# Altium schematic sheet Sheet1.SchDoc
size A4
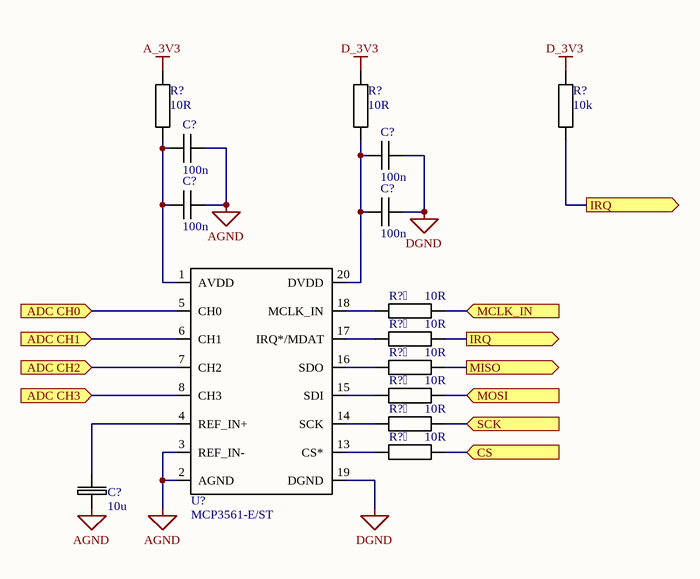
[diagram p0: Sheet1.SchDoc]

## Parts
(Parts that share a designator on the sheet are numbered #1, #2 ... from top to bottom, then left to right.)
C?#1  Capacitance: 100n  [1206 package]  (hidden comment: Ceramic Capacitor)
C?#2  Capacitance: 100n  [1206 package]  (hidden comment: Ceramic Capacitor)
C?#3  Capacitance: 100n  [1206 package]  (hidden comment: Ceramic Capacitor)
C?#4  Capacitance: 100n  [1206 package]  (hidden comment: Ceramic Capacitor)
C?#5  Capacitance: 10u  [B package]  (hidden comment: Electrolitic Capacitor)
R?#1  Resistance: 10R  [1206 package]  (hidden comment: SMD Resistor)
R?#2  Resistance: 10R  [1206 package]  (hidden comment: SMD Resistor)
R?#3  Resistance: 10R  [1206 package]  (hidden comment: SMD Resistor)
R?#4  Resistance: 10R  [1206 package]  (hidden comment: SMD Resistor)
R?#5  Resistance: 10R  [1206 package]  (hidden comment: SMD Resistor)
R?#6  Resistance: 10R  [1206 package]  (hidden comment: SMD Resistor)
R?#1  Resistance: 10R  [1206 package]  (hidden comment: SMD Resistor)
R?#2  Resistance: 10R  [1206 package]  (hidden comment: SMD Resistor)
R?#3  Resistance: 10k  [1206 package]  (hidden comment: SMD Resistor)
U?  MCP3561-E/ST

## Ports
ADC CH0 (in), ADC CH1 (in), ADC CH2 (in), ADC CH3 (in), CS (in), IRQ (out), MCLK_IN (in), MISO (out), MOSI (in), SCK (in)

## Nets
A_3V3: R?#1.2
AGND: C?#1.1 C?#3.1 C?#5.2 U?.2(AGND) U?.3(REF_IN-)
D_3V3: R?#2.2 R?#3.2
DGND: C?#2.1 C?#4.1 U?.19(DGND)
ADC CH0: U?.5(CH0) ; port ADC CH0
ADC CH1: U?.6(CH1) ; port ADC CH1
ADC CH2: U?.7(CH2) ; port ADC CH2
ADC CH3: U?.8(CH3) ; port ADC CH3
CS: R?#6.2 ; port CS
IRQ: R?#2.2 R?#3.1 ; port IRQ
MCLK_IN: R?#1.2 ; port MCLK_IN
MISO: R?#3.2 ; port MISO
MOSI: R?#4.2 ; port MOSI
SCK: R?#5.2 ; port SCK
NetC?#1_2: C?#1.2 C?#3.2 R?#1.1 U?.1(AVDD)
NetC?#2_2: C?#2.2 C?#4.2 R?#2.1 U?.20(DVDD)
NetC?#5_1: C?#5.1 U?.4(REF_IN+)
NetR?#1_1: R?#1.1 U?.18(MCLK_IN)
NetR?#2_1: R?#2.1 U?.17(IRQ*/MDAT)
NetR?#3_1: R?#3.1 U?.16(SDO)
NetR?#4_1: R?#4.1 U?.15(SDI)
NetR?#5_1: R?#5.1 U?.14(SCK)
NetR?#6_1: R?#6.1 U?.13(CS*)

## Library data of the parts
C?#5 = Electrolitic Capacitor: SMD Capacitor
R?#1-R?#6 R?#1-R?#3 = Resistor